# Altium schematic sheet 03_CellConnection.SchDoc
size Letter
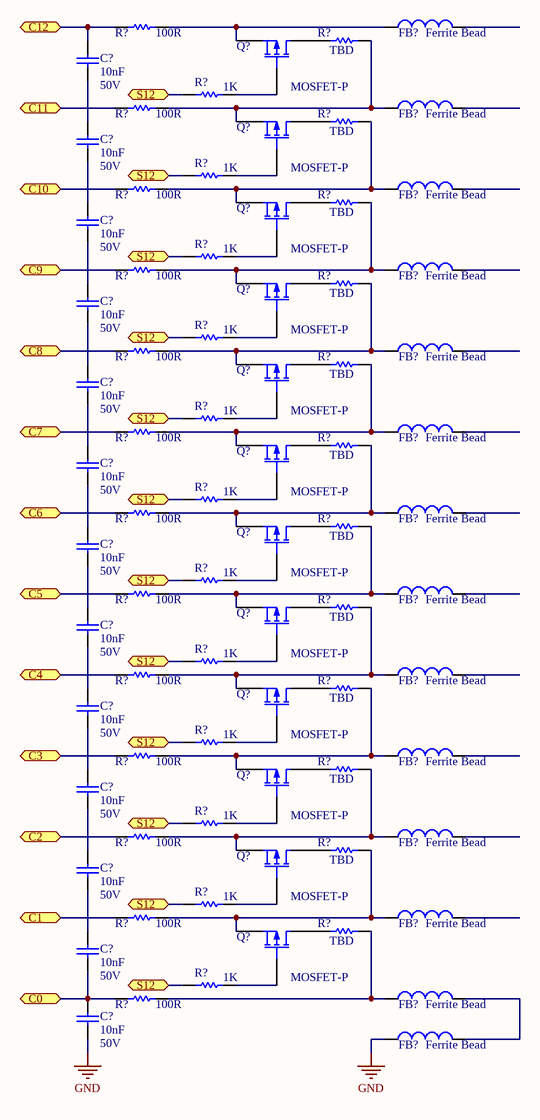
[diagram p0: 03_CellConnection.SchDoc]

## Parts
(Parts that share a designator on the sheet are numbered #1, #2 ... from top to bottom, then left to right.)
C?#1  10nF  Voltage: 50V  [CAPC1608X06N]
C?#2  10nF  Voltage: 50V  [CAPC1608X06N]
C?#3  10nF  Voltage: 50V  [CAPC1608X06N]
C?#4  10nF  Voltage: 50V  [CAPC1608X06N]
C?#5  10nF  Voltage: 50V  [CAPC1608X06N]
C?#6  10nF  Voltage: 50V  [CAPC1608X06N]
C?#7  10nF  Voltage: 50V  [CAPC1608X06N]
C?#8  10nF  Voltage: 50V  [CAPC1608X06N]
C?#9  10nF  Voltage: 50V  [CAPC1608X06N]
C?#10  10nF  Voltage: 50V  [CAPC1608X06N]
C?#11  10nF  Voltage: 50V  [CAPC1608X06N]
C?#12  10nF  Voltage: 50V  [CAPC1608X06N]
C?#13  10nF  Voltage: 50V  [CAPC1608X06N]
FB?#1  Ferrite Bead  [0402-A]
FB?#2  Ferrite Bead  [0402-A]
FB?#3  Ferrite Bead  [0402-A]
FB?#4  Ferrite Bead  [0402-A]
FB?#5  Ferrite Bead  [0402-A]
FB?#6  Ferrite Bead  [0402-A]
FB?#7  Ferrite Bead  [0402-A]
FB?#8  Ferrite Bead  [0402-A]
FB?#9  Ferrite Bead  [0402-A]
FB?#10  Ferrite Bead  [0402-A]
FB?#11  Ferrite Bead  [0402-A]
FB?#12  Ferrite Bead  [0402-A]
FB?#13  Ferrite Bead  [0402-A]
FB?#14  Ferrite Bead  [0402-A]
Q?#1  MOSFET-P  [E3]
Q?#2  MOSFET-P  [E3]
Q?#3  MOSFET-P  [E3]
Q?#4  MOSFET-P  [E3]
Q?#5  MOSFET-P  [E3]
Q?#6  MOSFET-P  [E3]
Q?#7  MOSFET-P  [E3]
Q?#8  MOSFET-P  [E3]
Q?#9  MOSFET-P  [E3]
Q?#10  MOSFET-P  [E3]
Q?#11  MOSFET-P  [E3]
Q?#12  MOSFET-P  [E3]
R?#1  value 100R  [AXIAL-0.3]  (hidden comment: Res1)
R?#2  value TBD  [AXIAL-0.3]  (hidden comment: Res1)
R?#3  value 1K  [AXIAL-0.3]  (hidden comment: Res1)
R?#4  value 100R  [AXIAL-0.3]  (hidden comment: Res1)
R?#5  value TBD  [AXIAL-0.3]  (hidden comment: Res1)
R?#6  value 1K  [AXIAL-0.3]  (hidden comment: Res1)
R?#7  value 100R  [AXIAL-0.3]  (hidden comment: Res1)
R?#8  value TBD  [AXIAL-0.3]  (hidden comment: Res1)
R?#9  value 1K  [AXIAL-0.3]  (hidden comment: Res1)
R?#10  value 100R  [AXIAL-0.3]  (hidden comment: Res1)
R?#11  value TBD  [AXIAL-0.3]  (hidden comment: Res1)
R?#12  value 1K  [AXIAL-0.3]  (hidden comment: Res1)
R?#13  value 100R  [AXIAL-0.3]  (hidden comment: Res1)
R?#14  value TBD  [AXIAL-0.3]  (hidden comment: Res1)
R?#15  value 1K  [AXIAL-0.3]  (hidden comment: Res1)
R?#16  value 100R  [AXIAL-0.3]  (hidden comment: Res1)
R?#17  value TBD  [AXIAL-0.3]  (hidden comment: Res1)
R?#18  value 1K  [AXIAL-0.3]  (hidden comment: Res1)
R?#19  value 100R  [AXIAL-0.3]  (hidden comment: Res1)
R?#20  value TBD  [AXIAL-0.3]  (hidden comment: Res1)
R?#21  value 1K  [AXIAL-0.3]  (hidden comment: Res1)
R?#22  value 100R  [AXIAL-0.3]  (hidden comment: Res1)
R?#23  value TBD  [AXIAL-0.3]  (hidden comment: Res1)
R?#24  value 1K  [AXIAL-0.3]  (hidden comment: Res1)
R?#25  value 100R  [AXIAL-0.3]  (hidden comment: Res1)
R?#26  value TBD  [AXIAL-0.3]  (hidden comment: Res1)
R?#27  value 1K  [AXIAL-0.3]  (hidden comment: Res1)
R?#28  value 100R  [AXIAL-0.3]  (hidden comment: Res1)
R?#29  value TBD  [AXIAL-0.3]  (hidden comment: Res1)
R?#30  value 1K  [AXIAL-0.3]  (hidden comment: Res1)
R?#31  value 100R  [AXIAL-0.3]  (hidden comment: Res1)
R?#32  value TBD  [AXIAL-0.3]  (hidden comment: Res1)
R?#33  value 1K  [AXIAL-0.3]  (hidden comment: Res1)
R?#34  value 100R  [AXIAL-0.3]  (hidden comment: Res1)
R?#35  value TBD  [AXIAL-0.3]  (hidden comment: Res1)
R?#36  value 1K  [AXIAL-0.3]  (hidden comment: Res1)
R?#37  value 100R  [AXIAL-0.3]  (hidden comment: Res1)

## Ports
C0, C1, C2, C3, C4, C5, C6, C7, C8, C9, C10, C11, C12, S12

## Nets
GND: C?#13.1 FB?#14.1
C0: C?#12.1 C?#13.2 R?#37.2 ; port C0
C1: R?#34.2 ; port C1
C2: R?#31.2 ; port C2
C3: R?#28.2 ; port C3
C4: R?#25.2 ; port C4
C5: R?#22.2 ; port C5
C6: R?#19.2 ; port C6
C7: R?#16.2 ; port C7
C8: R?#13.2 ; port C8
C9: R?#10.2 ; port C9
C10: R?#7.2 ; port C10
C11: R?#4.2 ; port C11
C12: C?#1.2 R?#1.2 ; port C12
S12: R?#3.2 R?#6.2 R?#9.2 R?#12.2 R?#15.2 R?#18.2 R?#21.2 R?#24.2 R?#27.2 R?#30.2 R?#33.2 R?#36.2 ; port S12
NetC?#1_1: C?#1.1 C?#2.2
NetC?#2_1: C?#2.1 C?#3.2
NetC?#3_1: C?#3.1 C?#4.2
NetC?#4_1: C?#4.1 C?#5.2
NetC?#5_1: C?#5.1 C?#6.2
NetC?#6_1: C?#6.1 C?#7.2
NetC?#7_1: C?#7.1 C?#8.2
NetC?#8_1: C?#8.1 C?#9.2
NetC?#9_1: C?#9.1 C?#10.2
NetC?#10_1: C?#10.1 C?#11.2
NetC?#11_1: C?#11.1 C?#12.2
NetFB?#1_1: FB?#1.1 Q?#1.3(S) R?#1.1
NetFB?#2_1: FB?#2.1 Q?#2.3(S) R?#2.1 R?#4.1
NetFB?#3_1: FB?#3.1 Q?#3.3(S) R?#5.1 R?#7.1
NetFB?#4_1: FB?#4.1 Q?#4.3(S) R?#8.1 R?#10.1
NetFB?#5_1: FB?#5.1 Q?#5.3(S) R?#11.1 R?#13.1
NetFB?#6_1: FB?#6.1 Q?#6.3(S) R?#14.1 R?#16.1
NetFB?#7_1: FB?#7.1 Q?#7.3(S) R?#17.1 R?#19.1
NetFB?#8_1: FB?#8.1 Q?#8.3(S) R?#20.1 R?#22.1
NetFB?#9_1: FB?#9.1 Q?#9.3(S) R?#23.1 R?#25.1
NetFB?#10_1: FB?#10.1 Q?#10.3(S) R?#26.1 R?#28.1
NetFB?#11_1: FB?#11.1 Q?#11.3(S) R?#29.1 R?#31.1
NetFB?#12_1: FB?#12.1 Q?#12.3(S) R?#32.1 R?#34.1
NetFB?#13_1: FB?#13.1 R?#35.1 R?#37.1
NetFB?#13_2: FB?#13.2 FB?#14.2
NetQ?#1_1: Q?#1.1(D) R?#2.2
NetQ?#1_2: Q?#1.2(G) R?#3.1
NetQ?#2_1: Q?#2.1(D) R?#5.2
NetQ?#2_2: Q?#2.2(G) R?#6.1
NetQ?#3_1: Q?#3.1(D) R?#8.2
NetQ?#3_2: Q?#3.2(G) R?#9.1
NetQ?#4_1: Q?#4.1(D) R?#11.2
NetQ?#4_2: Q?#4.2(G) R?#12.1
NetQ?#5_1: Q?#5.1(D) R?#14.2
NetQ?#5_2: Q?#5.2(G) R?#15.1
NetQ?#6_1: Q?#6.1(D) R?#17.2
NetQ?#6_2: Q?#6.2(G) R?#18.1
NetQ?#7_1: Q?#7.1(D) R?#20.2
NetQ?#7_2: Q?#7.2(G) R?#21.1
NetQ?#8_1: Q?#8.1(D) R?#23.2
NetQ?#8_2: Q?#8.2(G) R?#24.1
NetQ?#9_1: Q?#9.1(D) R?#26.2
NetQ?#9_2: Q?#9.2(G) R?#27.1
NetQ?#10_1: Q?#10.1(D) R?#29.2
NetQ?#10_2: Q?#10.2(G) R?#30.1
NetQ?#11_1: Q?#11.1(D) R?#32.2
NetQ?#11_2: Q?#11.2(G) R?#33.1
NetQ?#12_1: Q?#12.1(D) R?#35.2
NetQ?#12_2: Q?#12.2(G) R?#36.1

Not connected (* = marked no-connect by the designer): FB?#1 2; FB?#2 2; FB?#3 2; FB?#4 2; FB?#5 2; FB?#6 2; FB?#7 2; FB?#8 2; FB?#9 2; FB?#10 2; FB?#11 2; FB?#12 2

## Library data of the parts
C?#1-C?#13 = CAP CER 10nF 50V 5% X7R 0603: 10000pF ±5% 50V Ceramic Capacitor U2J 0603 (1608 Metric); Manufacturer: Kemet; ManufacturerPartNumber: C0603C103J5JAC7867; Value: 10nF; Supplier: Digi-Key; SupplierPartNumber: 399-13384-1-ND
FB?#1-FB?#14 = Inductor: Code_IEC: 1005; Published: 8-Jun-2000; LatestRevisionDate: 29-May-2009; LatestRevisionNote: IPC-7351 Footprint Added.; PackageReference: 0402-A; Publisher: Altium Limited; PackageDescription: Chip Inductor; Code_JEITA: 0402
Q?#1-Q?#12 = MOSFET-P: P-Channel MOSFET; Published: 8-Jun-2000; LatestRevisionDate: 17-Jul-2002; LatestRevisionNote: Re-released for DXP Platform.; PackageVersion: 1995/1996; PackageReference: E3; Publisher: Altium Limited; PackageDescription: TO, Flat Index; 3 In-Line, Axial Leads; Body Dia. 4.6mm; Lead Dia. 0.5 mm (max)
R?#1-R?#37 = Res1: Resistor; Published: 8-Jun-2000; LatestRevisionDate: 17-Jul-2002; LatestRevisionNote: Re-released for DXP Platform.; PackageReference: AXIAL-0.3; Publisher: Altium Limited; PackageDescription: Axial Device, Thru-Hole; 2 Leads; 0.3 in Pin Spacing